# Altium project TAG_V2.PrjPcb
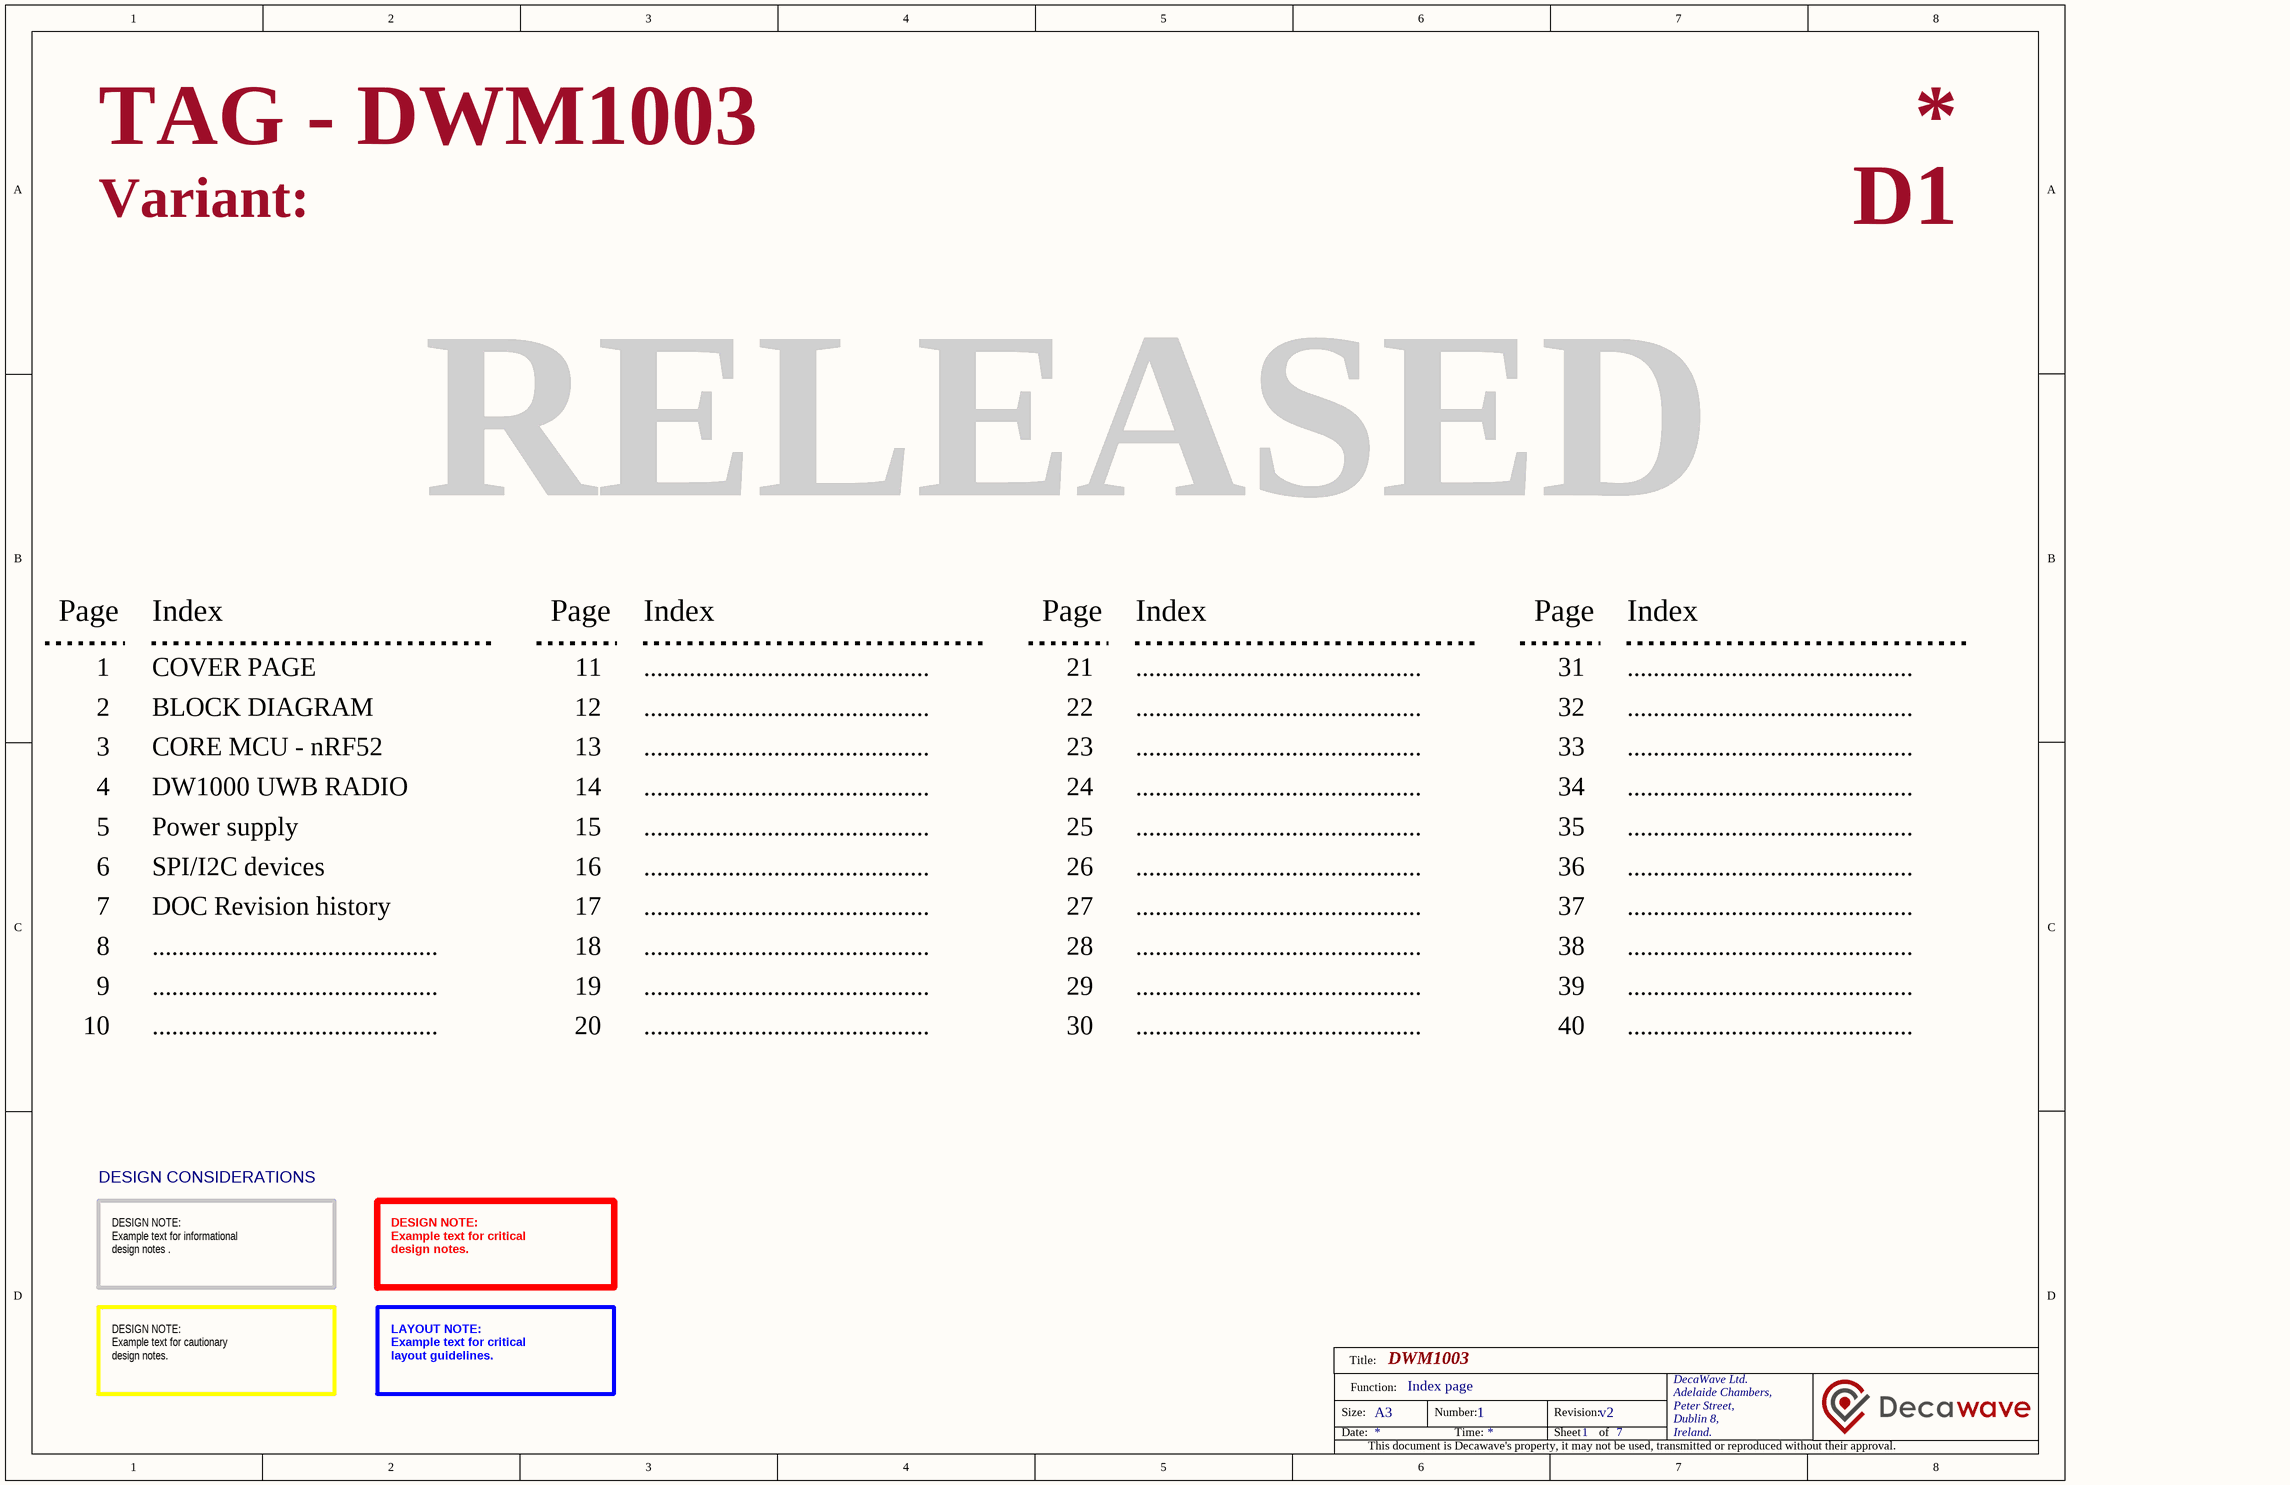
[diagram p0: [01] - COVER PAGE.SchDoc]
VersionRevision: D1; title: TAG_V2; Project_Title: 111; Project: TAG - DWM1003; DrawnBy: Ing. Jiri Kubias; Company: Decawave Limited
7 sheets, 120 parts. Net scope: flat (ports and power ports of the same name join across sheets).
Board file: TAG_V2.PcbDoc
Sheets:
  [01] - COVER PAGE.SchDoc
  [02] - BLOCK DIAGRAM.SchDoc
  [03] - CORE MCU.SchDoc
  [04] - DW radio.SchDoc
  [05] - Power supply.SchDoc
  [06] - SPI I2C devices.SchDoc
  [07] - DOC REVISION HISTORY.SchDoc

## Sheet [01] - COVER PAGE.SchDoc: DWM1003
size A3; DrawnBy: Ing. Jiri Kubias; DocumentNumber: 1; Revision: v2; SheetNumber: 1; SheetTotal: 7; SheetFunction: Index page

### Notes on the sheet
- Variant:
- RELEASED
- Page
- Index
- 1
- COVER PAGE
- 11
- ............................................
- 21
- 31
- 2
- 3
- BLOCK DIAGRAM
- CORE MCU - nRF52
- 12
- 13
- 22
- 23
- 32
- 33
- 4
- 5
- DW1000 UWB RADIO
- Power supply
- 14
- 15
- 24
- 25
- 34
- 35
- 6
- SPI/I2C devices
- 16
- 26
- 36
- 7
- 8
- DOC Revision history
- 17
- 18
- 27
- 28
- 37
- 38
- 9
- 10
- 19
- 20
- 29
- 30
- 39
- 40
- DESIGN CONSIDERATIONS
- DESIGN NOTE:
  Example text for informational
  design notes .
- DESIGN NOTE:
  Example text for critical
  design notes.
- DESIGN NOTE:
  Example text for cautionary
  design notes.
- LAYOUT NOTE:
  Example text for critical
  layout guidelines.
- Title:
- Size:
- Date:
- Function:
- A3
- Number:
- Time:
- Revision:
- Sheet
- of
- DecaWave Ltd.
- Adelaide Chambers,
- Peter Street,
- Dublin 8,
- Ireland.
- This document is Decawave's property, it may not be used, transmitted or reproduced without their approval.

## Sheet [02] - BLOCK DIAGRAM.SchDoc: DWM1003
size A3; DocumentNumber: 2; Revision: v2; SheetNumber: 2; SheetTotal: 7; SheetFunction: Block Diagram
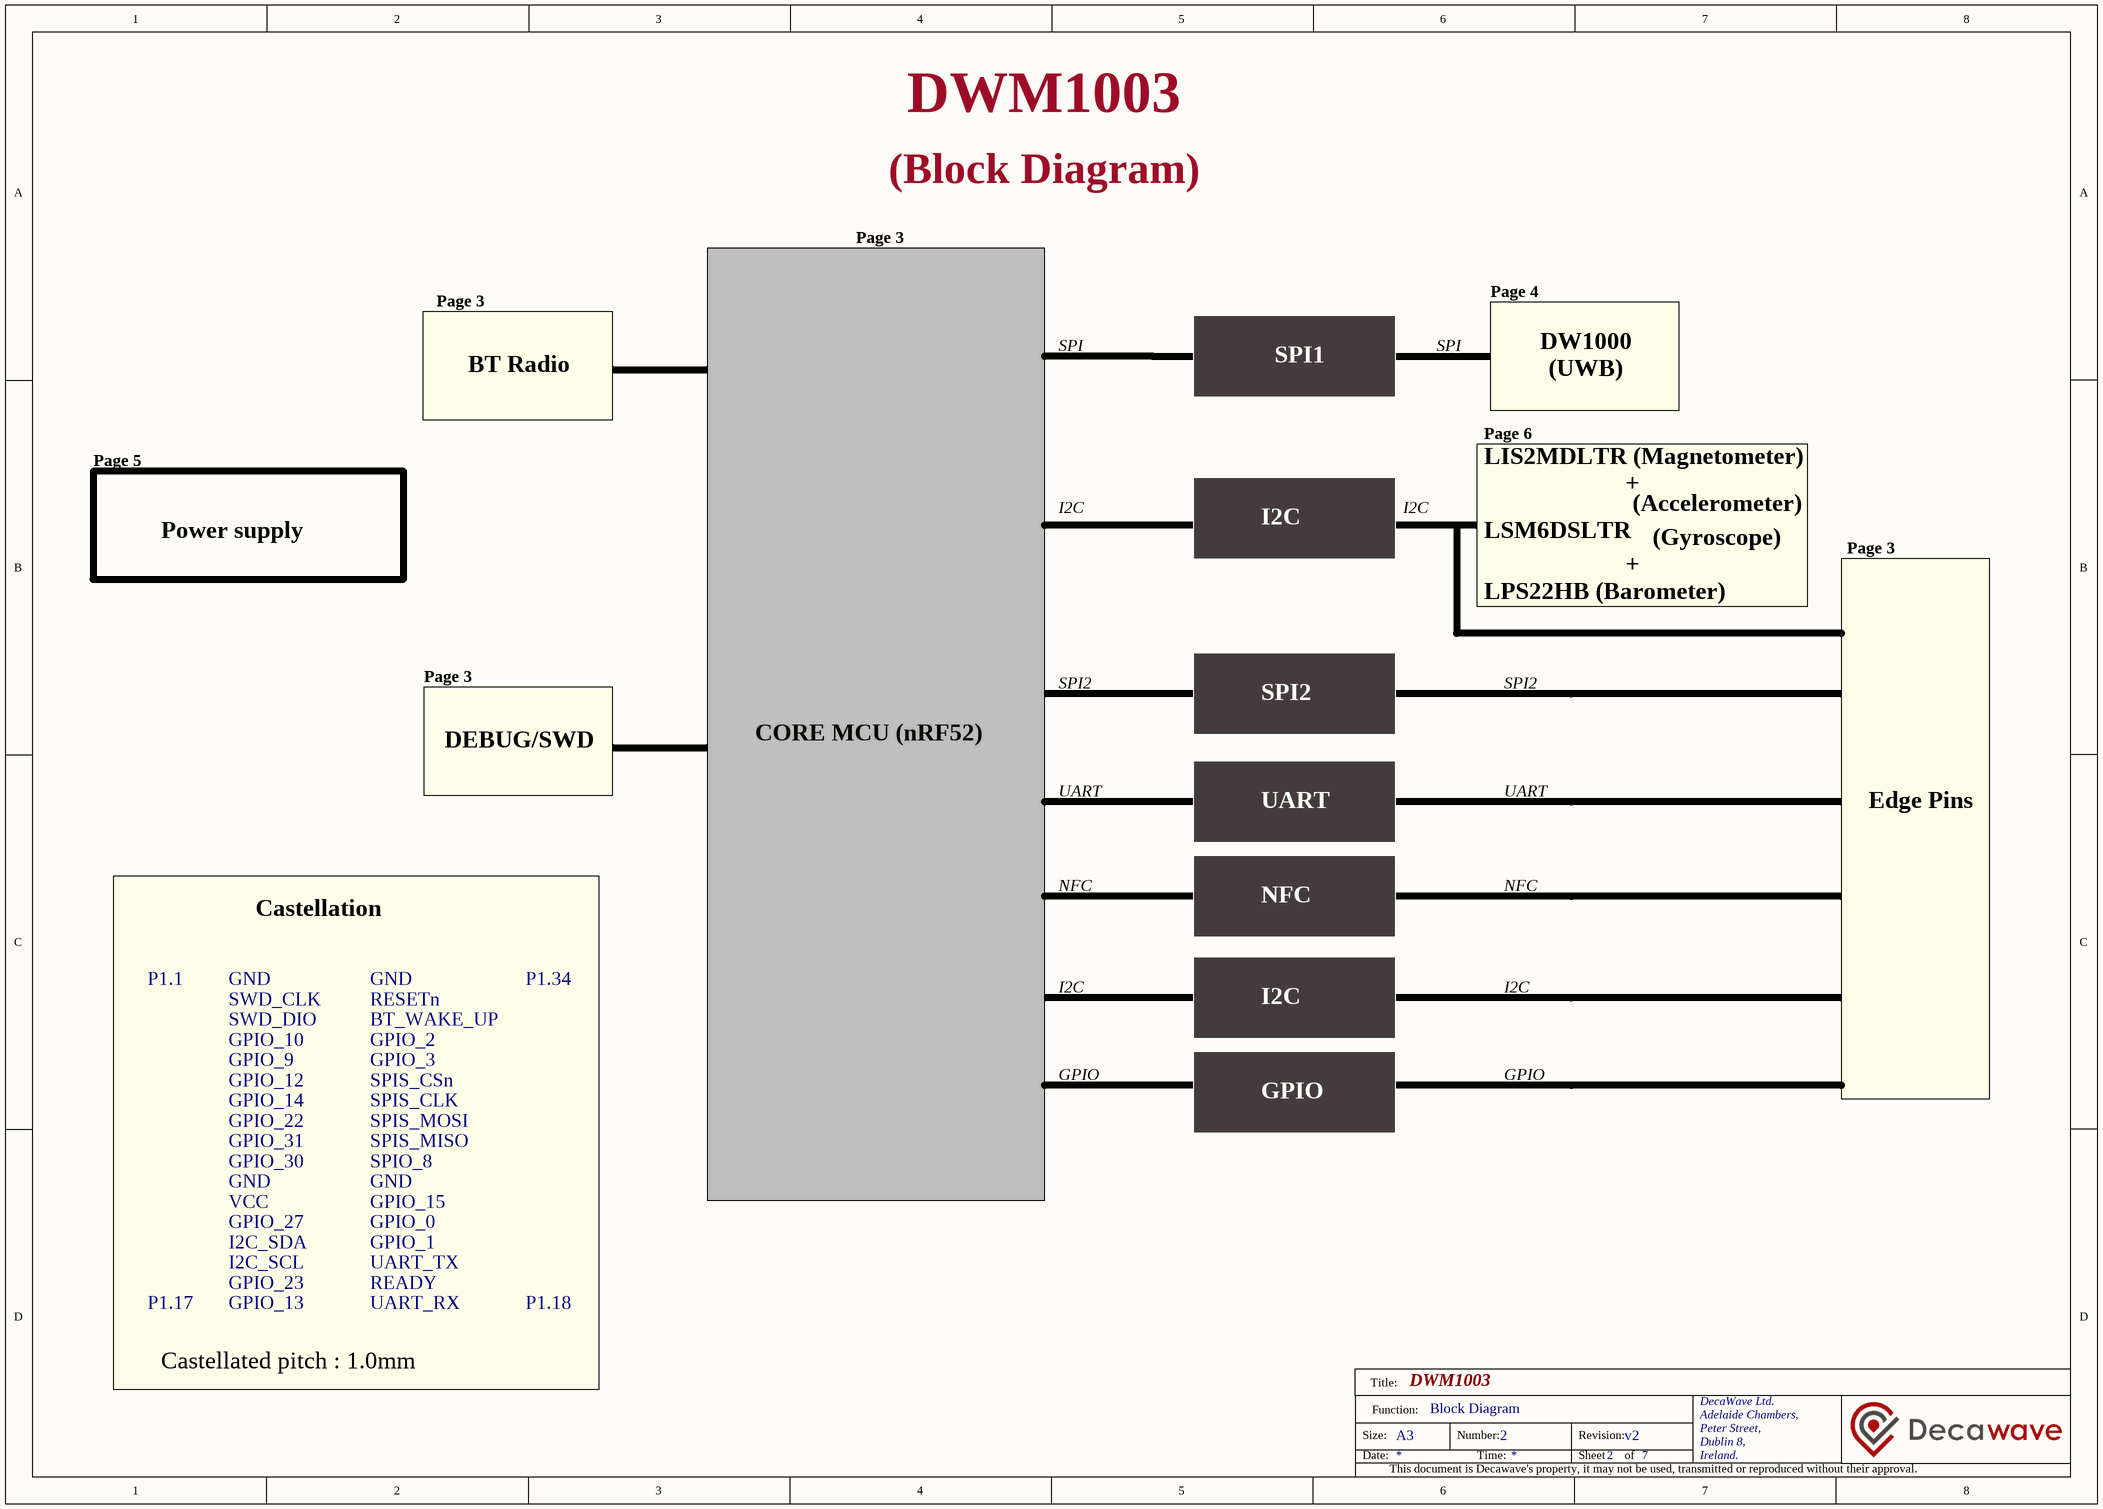
[diagram p1: [02] - BLOCK DIAGRAM.SchDoc]

### Notes on the sheet
- DWM1003
- Page 3
- (Block Diagram)
- Page 4
- BT Radio
- SPI
- SPI1
- DW1000
- (UWB)
- Page 6
- Page 5
- I2C
- LIS2MDLTR (Magnetometer)
- +
- (Accelerometer)
- Power supply
- LSM6DSLTR
- (Gyroscope)
- LPS22HB (Barometer)
- SPI2
- DEBUG/SWD
- CORE MCU (nRF52)
- UART
- Edge Pins
- Castellation
- NFC
- P1.1
- GND
- P1.34
- SWD_CLK
- SWD_DIO
- GPIO_10
- RESETn
- BT_WAKE_UP
- GPIO_2
- GPIO_9
- GPIO_12
- GPIO_14
- GPIO_22
- GPIO_3
- SPIS_CSn
- SPIS_CLK
- SPIS_MOSI
- GPIO
- GPIO_30
- GPIO_31
- SPIS_MISO
- SPIO_8
- VCC
- GPIO_27
- I2C_SDA
- GPIO_15
- GPIO_0
- GPIO_1
- P1.17
- GPIO_13
- GPIO_23
- I2C_SCL
- UART_TX
- READY
- UART_RX
- P1.18
- Castellated pitch : 1.0mm
- Title:
- Size:
- Date:
- Function:
- A3
- Number:
- Time:
- Revision:
- Sheet
- of
- DecaWave Ltd.
- Adelaide Chambers,
- Peter Street,
- Dublin 8,
- Ireland.
- This document is Decawave's property, it may not be used, transmitted or reproduced without their approval.

## Sheet [03] - CORE MCU.SchDoc: DWM1003
size A4; DocumentNumber: 3; Revision: v2; SheetNumber: 3; SheetTotal: 7; SheetFunction: nRF MCU
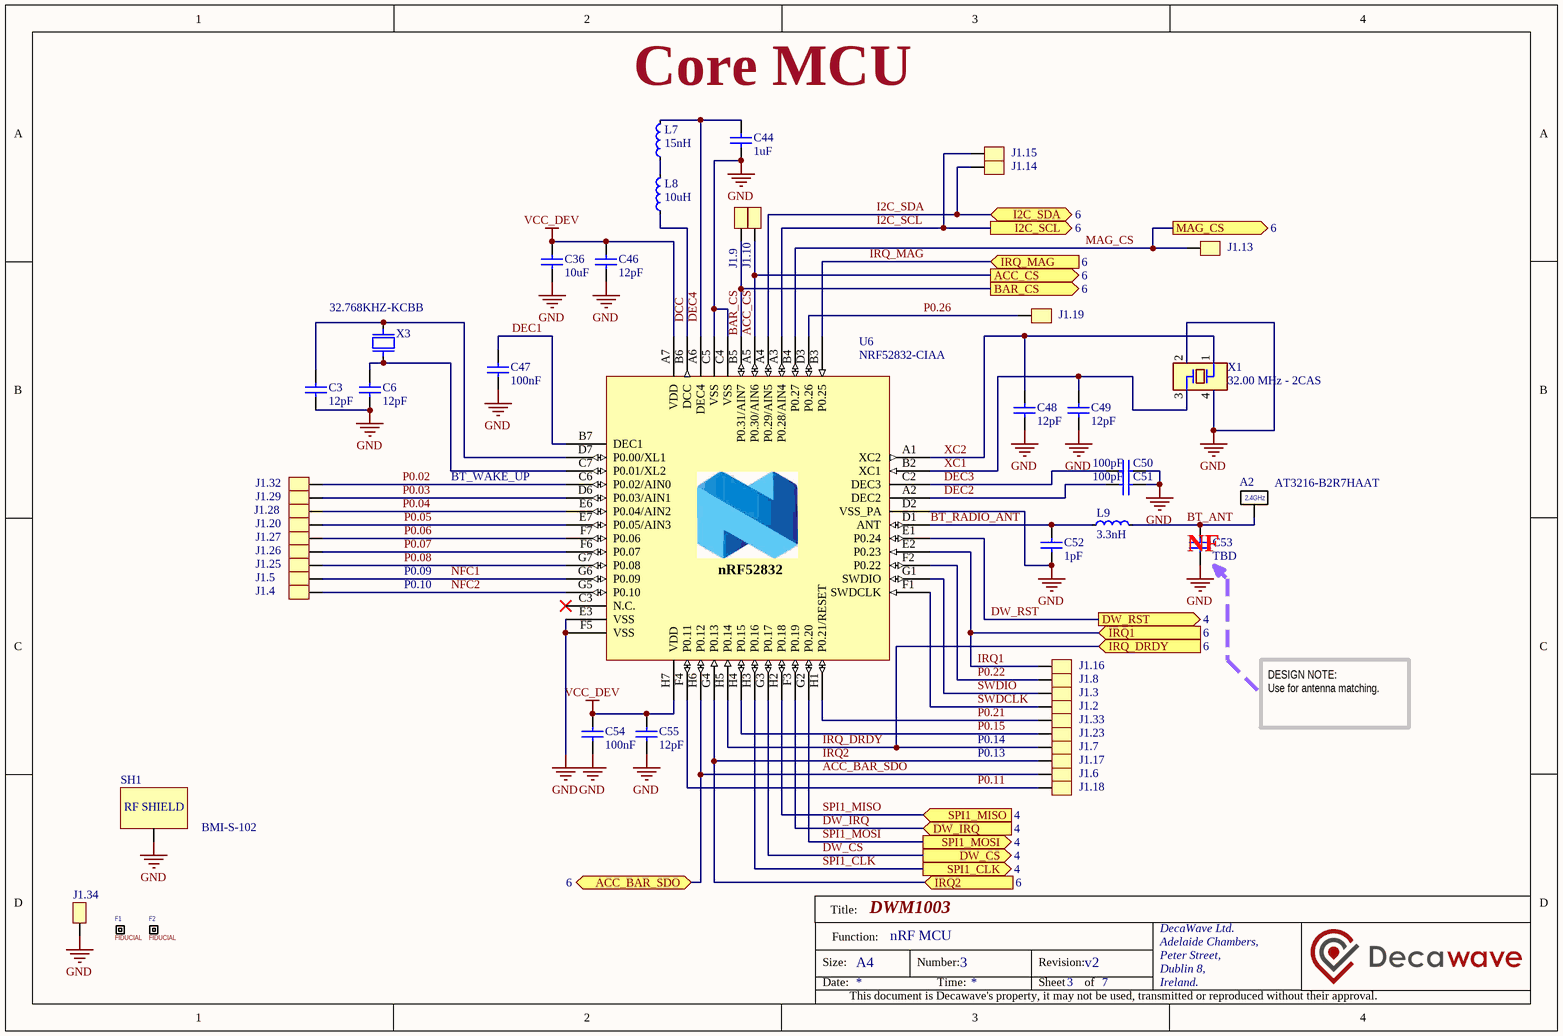
[diagram p2: [03] - CORE MCU.SchDoc]

### Parts
A2  AT3216-B2R7HAAT  [AT3216]
C3  12pF  [C0201]
C6  12pF  [C0201]
C36  10uF  [C0603]
C44  1uF  [C0402]
C46  12pF  [C0201]
C47  100nF  [C0201]
C48  12pF  [C0201]
C49  12pF  [C0201]
C50  100pF  [C0201]
C51  100pF  [C0201]
C52  1pF  [C0201]
C53  TBD  [C0201]
C54  100nF  [C0201]
C55  12pF  [C0201]
F1  FIDUCIAL  [FID1]
F2  FIDUCIAL  [FID1]
J1.2  EDGE_PIN  [PCB_EDGE_1MM]  (value not drawn)
J1.3  EDGE_PIN  [PCB_EDGE_1MM]  (value not drawn)
J1.4  EDGE_PIN  [PCB_EDGE_1MM]  (value not drawn)
J1.5  EDGE_PIN  [PCB_EDGE_1MM]  (value not drawn)
J1.6  EDGE_PIN  [PCB_EDGE_1MM]  (value not drawn)
J1.7  EDGE_PIN  [PCB_EDGE_1MM]  (value not drawn)
J1.8  EDGE_PIN  [PCB_EDGE_1MM]  (value not drawn)
J1.9  EDGE_PIN  [PCB_EDGE_1MM]  (value not drawn)
J1.10  EDGE_PIN  [PCB_EDGE_1MM]  (value not drawn)
J1.13  EDGE_PIN  [PCB_EDGE_1MM]  (value not drawn)
J1.14  EDGE_PIN  [PCB_EDGE_1MM]  (value not drawn)
J1.15  EDGE_PIN  [PCB_EDGE_1MM]  (value not drawn)
J1.16  EDGE_PIN  [PCB_EDGE_1MM]  (value not drawn)
J1.17  EDGE_PIN  [PCB_EDGE_1MM]  (value not drawn)
J1.18  EDGE_PIN  [PCB_EDGE_1MM]  (value not drawn)  (no BOM)
J1.19  EDGE_PIN  [PCB_EDGE_1MM]  (value not drawn)  (no BOM)
J1.20  EDGE_PIN  [PCB_EDGE_1MM]  (value not drawn)  (no BOM)
J1.23  EDGE_PIN  [PCB_EDGE_1MM]  (value not drawn)
J1.25  EDGE_PIN  [PCB_EDGE_1MM]  (value not drawn)
J1.26  EDGE_PIN  [PCB_EDGE_1MM]  (value not drawn)
J1.27  EDGE_PIN  [PCB_EDGE_1MM]  (value not drawn)
J1.28  EDGE_PIN  [PCB_EDGE_1MM]  (value not drawn)
J1.29  EDGE_PIN  [PCB_EDGE_1MM]  (value not drawn)
J1.32  EDGE_PIN  [PCB_EDGE_1MM]  (value not drawn)
J1.33  EDGE_PIN  [PCB_EDGE_1MM]  (value not drawn)
J1.34  EDGE_PIN  [PCB_EDGE_1MM]  (value not drawn)
L7  15nH  [INDC1005X05N]
L8  10uH  [L0603]
L9  3.3nH  [L0201]
SH1  BMI-S-102  [BMI-S102]
U6  NRF52832-CIAA  [BGA50C40P7X8_295X322X50]
X1  32.00 MHz - 2CAS  [ABM10]
X3  32.768KHZ-KCBB  [XTAL_SMD_3.2X1.5MM]

### Ports
ACC_BAR_SDO (bidir, see 6), ACC_CS (out, see 6), BAR_CS (out, see 6), DW_CS (out, see 4), DW_IRQ (in, see 4), DW_RST (out, see 4), I2C_SCL (out, see 6), I2C_SDA (bidir, see 6), IRQ1 (in, see 6), IRQ2 (in, see 6), IRQ_DRDY (in, see 6), IRQ_MAG (in, see 6), MAG_CS (out, see 6), SPI1_CLK (out, see 4), SPI1_MISO (in, see 4), SPI1_MOSI (out, see 4)

### Nets
GND: C3.1 C6.1 C36.1 C44.1 C46.1 C47.1 C48.1 C49.1 C50.1 C51.1 C52.1 C53.1 C54.1 C55.1 J1.34.0 SH1.0(GND) U6.C4(VSS) U6.C5(VSS) U6.D2(VSS_PA) U6.E3(VSS) U6.F5(VSS) X1.2 X1.4
VCC_DEV: C36.2 C46.2 C54.2 C55.2 U6.A7(VDD) U6.H7(VDD)
ACC_BAR_SDO: J1.6.0 U6.H6(P0.12) ; port ACC_BAR_SDO
ACC_CS: J1.10.0 U6.A5(P0.30/AIN6) ; port ACC_CS
BAR_CS: J1.9.0 U6.B5(P0.31/AIN7) ; port BAR_CS
BT_ANT: A2.1 C53.2 L9.2
BT_RADIO_ANT: C52.2 L9.1 U6.D1(ANT)
DCC: L8.1 U6.B6(DCC)
DEC1: C47.2 U6.B7(DEC1)
DEC2: C51.2 U6.A2(DEC2)
DEC3: C50.2 U6.C2(DEC3)
DEC4: C44.2 L7.2 U6.A6(DEC4)
DW_CS: U6.G3(P0.17) ; port DW_CS
DW_IRQ: U6.F3(P0.19) ; port DW_IRQ
DW_RST: U6.E1(P0.24) ; port DW_RST
I2C_SCL: J1.15.0 U6.A3(P0.28/AIN4) ; port I2C_SCL
I2C_SDA: J1.14.0 U6.A4(P0.29/AIN5) ; port I2C_SDA
IRQ1: J1.16.0 U6.E2(P0.23) ; port IRQ1
IRQ2: J1.17.0 U6.G4(P0.13) ; port IRQ2
IRQ_DRDY: J1.7.0 U6.H5(P0.14) ; port IRQ_DRDY
IRQ_MAG: U6.B3(P0.25) ; port IRQ_MAG
MAG_CS: J1.13.0 U6.B4(P0.27) ; port MAG_CS
NFC1: J1.5.0 U6.G6(P0.09)
NFC2: J1.4.0 U6.G5(P0.10)
P0.02: J1.32.0 U6.C6(P0.02/AIN0)
P0.03: J1.29.0 U6.D6(P0.03/AIN1)
P0.04: J1.28.0 U6.E6(P0.04/AIN2)
P0.05: J1.20.0 U6.E7(P0.05/AIN3)
P0.06: J1.27.0 U6.F7(P0.06)
P0.07: J1.26.0 U6.F6(P0.07)
P0.08: J1.25.0 U6.G7(P0.08)
P0.11: J1.18.0 U6.F4(P0.11)
P0.15: J1.23.0 U6.H4(P0.15)
P0.21: J1.33.0 U6.H1(P0.21/RESET)
P0.22: J1.8.0 U6.F2(P0.22)
P0.26: J1.19.0 U6.D3(P0.26)
SPI1_CLK: U6.H3(P0.16) ; port SPI1_CLK
SPI1_MISO: U6.H2(P0.18) ; port SPI1_MISO
SPI1_MOSI: U6.G2(P0.20) ; port SPI1_MOSI
SWDCLK: J1.2.0 U6.F1(SWDCLK)
SWDIO: J1.3.0 U6.G1(SWDIO)
XC1: C49.2 U6.B2(XC1) X1.3
XC2: C48.2 U6.A1(XC2) X1.1
NetC3_2: C3.2 U6.D7(P0.00/XL1) X3.2
NetC6_2: C6.2 U6.C7(P0.01/XL2) X3.1
NetL7_1: L7.1 L8.2

Not connected (* = marked no-connect by the designer): U6 C3(N.C.)*

### Notes on the sheet
- Core MCU
- BT_WAKE_UP
- P0.09
- (near C53) NF
- P0.10
- DESIGN NOTE:
  Use for antenna matching.
- P0.14
- P0.13
- Title:
- Size:
- Date:
- Function:
- A4
- Number:
- Time:
- Revision:
- Sheet
- of
- DecaWave Ltd.
- Adelaide Chambers,
- Peter Street,
- Dublin 8,
- Ireland.
- This document is Decawave's property, it may not be used, transmitted or reproduced without their approval.
- (in symbol AT3216-B2R7HAAT) 2.4GHz
- (in symbol BMI-S-102) RF SHIELD
- (in symbol NRF52832-CIAA-R) nRF52832

### Library data of the parts
A2 = AT3216-B2R7HAAT: CHIP, 2.45GHZ, 50 OHM, 3.2x1.6 ACX - AAT3216-B2R7HAAT- ANTENNA; Manufacturer: ACX; Manufacturer Part Number: AT3216-B2R7HAAT
C3 C6 C46 C48 C49 C55 = GRM0335C1E120JA01D: CAP CER 12PF 25V NP0 0201; Manufacturer: Murata Electronics North America; Manufacturer Part Number: GRM0335C1E120JA01D
C36 = GRM188R60J106ME84D: CAP CER 10UF 6.3V X5R 0603; Manufacturer: Murata Electronics North America; Manufacturer Part Number: GRM188R60J106ME47D
C44 = GRM155R61A105KE15D: CAP CER 1UF 10V X5R 0402; Manufacturer: Murata Electronics North America; Manufacturer Part Number: GRM155R61A105KE15D
C47 C54 = GRM033C81E104ME14D: CAP CER 0.1UF 25V X6S 0201; Manufacturer: Murata Electronics North America; Manufacturer Part Number: GRM033C81E104ME14D
C50 C51 = GRM0335C1E101JA01D: CAP CER 100PF 25V NP0 0201; Manufacturer: Murata Electronics North America; Manufacturer Part Number: GRM0335C1E101JA01D
C52 C53 = GRM0335C1H1R0BA01D: CAP CER 1PF 50V NP0 0201; Manufacturer: Murata Electronics North America; Manufacturer Part Number: GRM0335C1H1R0BA01D
F1 F2 = FID1: Fiducial 1mm
J1.2-J1.10 J1.13-J1.20 J1.23 J1.25-J1.29 J1.32-J1.34 = EDGE_PIN: PCB Edge pin
L7 = HK100515NJ-T: FIXED IND 15NH 320MA 460 MOHM; Manufacturer: Taiyo Yuden; Manufacturer Part Number: HK100515NJ-T
L8 = LBMF1608T100K: FIXED IND 10UH 80MA 360 MOHM SMD; Manufacturer: Taiyo Yuden; Manufacturer Part Number: LBMF1608T100K
L9 = LQP03TG3N3C02D: FIXED IND 3.3NH 400MA 320 MOHM; Manufacturer: Murata Electronics North America; Manufacturer Part Number: LQP03TG3N3C02D
SH1 = BMI-S-102: BOARD SHIELD .65X.65" 1PIECE; Manufacturer: Laird Technologies EMI; Manufacturer Part Number: BMI-S-102
U6 = NRF52832-CIAA-R: IC RF TXRX+MCU BLUETOOTH 50WLCSP; Manufacturer: Nordic Semiconductor ASA; Manufacturer Part Number: NRF52832-CIAA-R; RF Family/Standard: *; Protocol: *; Modulation: *; Frequency: *; Data Rate (Max): *; Power - Output: *; Sensitivity: *; Memory Size: *; Serial Interfaces: *; GPIO: *; Voltage - Supply: *; Current - Receiving: *; Current - Transmitting: *; Operating Temperature: *
X1 = ABM10: Manufacturer: Commutek; Manufacturer Part Number: 2CAS
X3 = ABS06-32.768KHZ-T: CRYSTAL 32.7680KHZ 12.5PF SMD; Manufacturer: Commutek; Manufacturer Part Number: KCBB

## Sheet [04] - DW radio.SchDoc: DWM1003
size A4; DocumentNumber: 4; Revision: v2; SheetNumber: 4; SheetTotal: 7; SheetFunction: DW1000
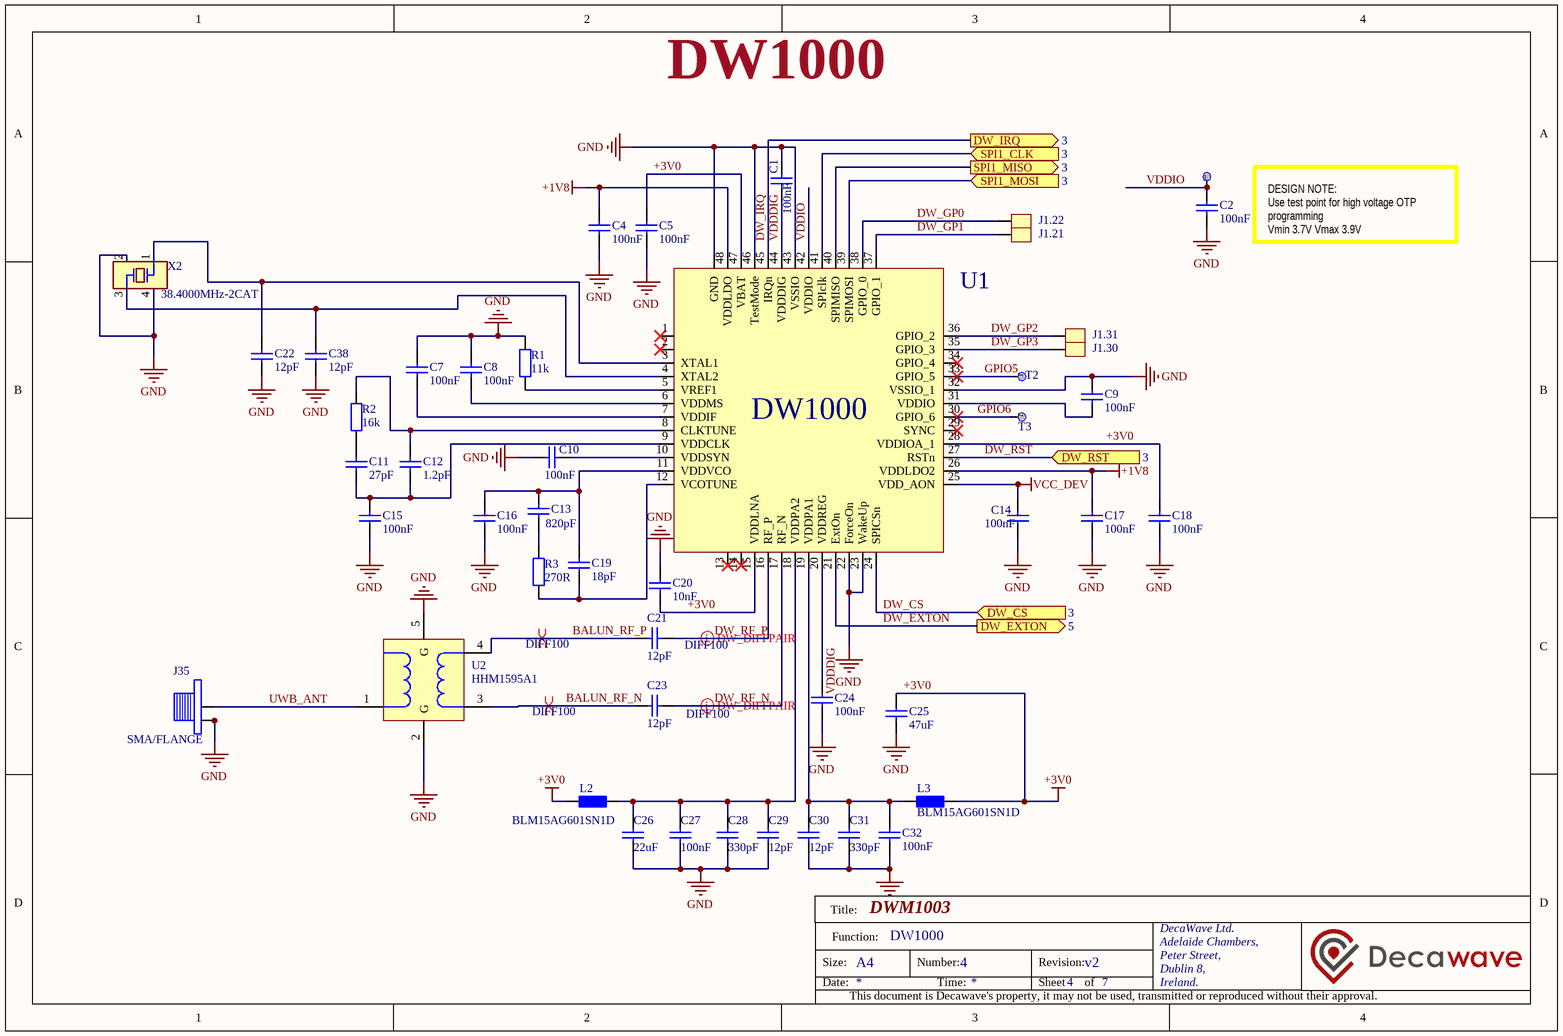
[diagram p3: [04] - DW radio.SchDoc]

### Parts
C1  100nF  [C0201]
C2  100nF  [C0201]
C4  100nF  [C0201]
C5  100nF  [C0201]
C7  100nF  [C0201]
C8  100nF  [C0201]
C9  100nF  [C0201]
C10  100nF  [C0201]
C11  27pF  [C0201]
C12  1.2pF  [C0201]
C13  820pF  [C0201]
C14  100nF  [C0201]
C15  100nF  [C0201]
C16  100nF  [C0201]
C17  100nF  [C0201]
C18  100nF  [C0201]
C19  18pF  [C0201]
C20  10nF  [C0201]
C21  12pF  [C0201]
C22  12pF  [C0201]
C23  12pF  [C0201]
C24  100nF  [C0201]
C25  47uF  [C0805]
C26  22uF  [C0805]
C27  100nF  [C0201]
C28  330pF  [C0201]
C29  12pF  [C0201]
C30  12pF  [C0201]
C31  330pF  [C0201]
C32  100nF  [C0201]
C38  12pF  [C0201]
J1.21  EDGE_PIN  [PCB_EDGE_1MM]  (value not drawn)  (no BOM)
J1.22  EDGE_PIN  [PCB_EDGE_1MM]  (value not drawn)  (no BOM)
J1.30  EDGE_PIN  [PCB_EDGE_1MM]  (value not drawn)  (no BOM)
J1.31  EDGE_PIN  [PCB_EDGE_1MM]  (value not drawn)  (no BOM)
J35  SMA/FLANGE  [SMA_KHD3800]
L2  BLM15AG601SN1D  [INDC1005X05N]
L3  BLM15AG601SN1D  [INDC1005X05N]
R1  11k  [R0201]
R2  16k  [R0201]
R3  270R  [R0201]
T1  TestPAD  [Testpad]  (value not drawn)
T2  TestPAD  [Testpad]  (value not drawn)
T3  TestPAD  [Testpad]  (value not drawn)
U1  DW1000 IC  [QFN-48_DW1000]  (value not drawn)
U2  HHM1595A1  [BALUN_HHM1595A1]
X2  38.4000MHz-2CAT  [ABM10]

### Ports
DW_CS (in, see 3), DW_EXTON (out, see 5), DW_IRQ (out, see 3), DW_RST (in, see 3), SPI1_CLK (in, see 3), SPI1_MISO (out, see 3), SPI1_MOSI (in, see 3)

### Nets
+1V8: C4.2 C17.2 U1.26(VDDLDO2) U1.48(VDDLDO)
+3V0: C5.2 C18.2 C20.1 C25.2 L2.1 L3.2 U1.15(VDDLNA) U1.28(VDDIOA_1) U1.47(VBAT)
GND: C1.1 C2.1 C4.1 C5.1 C7.2 C8.2 C9.2 C10.2 C14.1 C15.1 C16.1 C17.1 C18.1 C20.2 C22.1 C24.1 C25.1 C26.1 C27.1 C28.1 C29.1 C30.1 C31.1 C32.1 C38.1 J35.2 J35.3 J35.4 J35.5 R1.2 U1.22(ForceOn) U1.23(WakeUp) U1.32(VSSIO_1) U1.43(VSSIO) U1.46(TestMode) U1.EP(GND) U2.2(G) U2.5(G) X2.2 X2.4
VCC_DEV: C14.2 U1.25(VDD_AON)
BALUN_RF_N: C23.1 U2.3(B)
BALUN_RF_P: C21.1 U2.4(B)
DW_CS: U1.24(SPICSn) ; port DW_CS
DW_EXTON: U1.21(ExtOn) ; port DW_EXTON
DW_GP0: J1.22.0 U1.38(GPIO_0)
DW_GP1: J1.21.0 U1.37(GPIO_1)
DW_GP2: J1.31.0 U1.36(GPIO_2)
DW_GP3: J1.30.0 U1.35(GPIO_3)
DW_IRQ: U1.45(IRQn) ; port DW_IRQ
DW_RF_N: C23.2 U1.17(RF_N)
DW_RF_P: C21.2 U1.16(RF_P)
DW_RST: U1.27(RSTn) ; port DW_RST
GPIO5: T2.1 U1.33(GPIO_5)
GPIO6: T3.1 U1.30(GPIO_6)
SPI1_CLK: U1.41(SPIclk) ; port SPI1_CLK
SPI1_MISO: U1.40(SPIMISO) ; port SPI1_MISO
SPI1_MOSI: U1.39(SPIMOSI) ; port SPI1_MOSI
UWB_ANT: J35.1 U2.1(UB)
VDDDIG: C1.2 C24.2 U1.20(VDDREG) U1.44(VDDDIG)
VDDIO: C2.2 T1.1 U1.42(VDDIO)
NetC7_1: C7.1 U1.7(VDDIF)
NetC8_1: C8.1 U1.6(VDDMS)
NetC9_1: C9.1 U1.31(VDDIO)
NetC10_1: C10.1 U1.10(VDDSYN)
NetC11_1: C11.1 C12.1 C15.2 U1.9(VDDCLK)
NetC11_2: C11.2 R2.1
NetC12_2: C12.2 R2.2 U1.8(CLKTUNE)
NetC13_1: C13.1 R3.2
NetC13_2: C13.2 C16.2 C19.2 U1.11(VDDVCO)
NetC19_1: C19.1 R3.1 U1.12(VCOTUNE)
NetC22_2: C22.2 U1.3(XTAL1) X2.1
NetC26_2: C26.2 C27.2 C28.2 C29.2 L2.2 U1.18(VDDPA2)
NetC30_2: C30.2 C31.2 C32.2 L3.1 U1.19(VDDPA1)
NetC38_2: C38.2 U1.4(XTAL2) X2.3
NetR1_1: R1.1 U1.5(VREF1)

Not connected (* = marked no-connect by the designer): U1 1* 2* 13* 14* 29(SYNC)* 34(GPIO_4)*

### Layout directives
differential pair; net class DIFF100: DW_RF_N, DW_RF_P
differential pair; Class: DIFF100: BALUN_RF_N, BALUN_RF_P

### Notes on the sheet
- DW1000
- DESIGN NOTE:
  Use test point for high voltage OTP programming
  Vmin 3.7V Vmax 3.9V
- Title:
- Size:
- Date:
- Function:
- A4
- Number:
- Time:
- Revision:
- Sheet
- of
- DecaWave Ltd.
- Adelaide Chambers,
- Peter Street,
- Dublin 8,
- Ireland.
- This document is Decawave's property, it may not be used, transmitted or reproduced without their approval.
- (in symbol TestPAD) T

### Library data of the parts
C1 C2 C4 C5 C7-C10 C14-C18 C24 C27 C32 = GRM033C81E104ME14D: as C47 on sheet [03] - CORE MCU; Manufacturer Part Number: GRM033C81E104ME14D
C11 = GRM0335C1E270JA01D: CAP CER 27PF 25V NP0 0201; Manufacturer: Murata Electronics North America; Manufacturer Part Number: GRM0335C1E270JA01D
C12 = GRM0335C1E1R2CA01D: CAP CER 1.2PF 25V NP0 0201; Manufacturer: Murata Electronics North America; Manufacturer Part Number: GRM0335C1E1R2CA01D
C13 = GRM033R71E821KA01D: CAP CER 820PF 25V X7R 0201; Manufacturer: Murata Electronics North America; Manufacturer Part Number: GRM033R71E821KA01D
C19 = GRM0335C1H180JA01D: CAP CER 18PF 50V NP0 0201; Manufacturer: Murata Electronics North America; Manufacturer Part Number: GRM0335C1H180JA01D; Thickness (Max): *
C20 = GRM033R61E103KA12D: CAP CER 10000PF 25V X5R 0201; Manufacturer: Murata Electronics North America; Manufacturer Part Number: GRM033R61E103KA12D
C21-C23 C29 C30 C38 = GRM0335C1E120JA01D: as C3 on sheet [03] - CORE MCU; Manufacturer Part Number: GRM0335C1E120JA01D
C25 = GRM21BR60J226ME39L: CAP CER 47UF 6.3V X5R 0603; Manufacturer: Murata Electronics North America; Manufacturer Part Number: GRM188R60J476ME15D
C26 = GRM21BR60J226ME39L: CAP CER 22UF 6.3V X5R 0805; Manufacturer: Samsung; Manufacturer Part Number: CL21A226MQQNNNE
C28 C31 = GRM033R71E331KA01D: CAP CER 330PF 25V X7R 0201; Manufacturer: Samsung; Manufacturer Part Number: CL03B331KA3NNNC
J1.21 J1.22 J1.30 J1.31 = EDGE_PIN: PCB Edge pin
J35 = SMA/FLANGE: SMA FLANGE JACK
L2 L3 = BLM15AG601SN1D: FERRITE BEAD 600 OHM 0402 1LN; Manufacturer: Murata Electronics North America; Manufacturer Part Number: BLM15AG601SN1D
R1 = RC0201FR-0711KL: RES SMD 11K OHM 1% 1/20W 0201; Manufacturer: Yageo; Manufacturer Part Number: RC0201FR-0711KL
R2 = RC0201FR-0716KL: RES SMD 16K OHM 1% 1/20W 0201; Manufacturer: Yageo; Manufacturer Part Number: RC0201FR-0716KL
R3 = RC0201FR-07270RL: RES SMD 270 OHM 1% 1/20W 0201; Manufacturer: Yageo; Manufacturer Part Number: RC0201FR-07270RL
U1 = DW1000_QFN_48: UWB DW1000 QFN48; Manufacturer: Decawave Ltd.; Cost: *; Footprint: QFN_48; Manufacturer Part Number: DW1000
U2 = IND_BALUN_HHM1595A1: Mulitilayer Balun; Manufacturer: TDK; Manufacturer Part Number: HHM1595A1
X2 = ABM10: Manufacturer: Commutek; Manufacturer Part Number: 2CAT

## Sheet [05] - Power supply.SchDoc: DWM1003
size A4; DocumentNumber: 5; Revision: v2; SheetNumber: 5; SheetTotal: 7; SheetFunction: Power supply
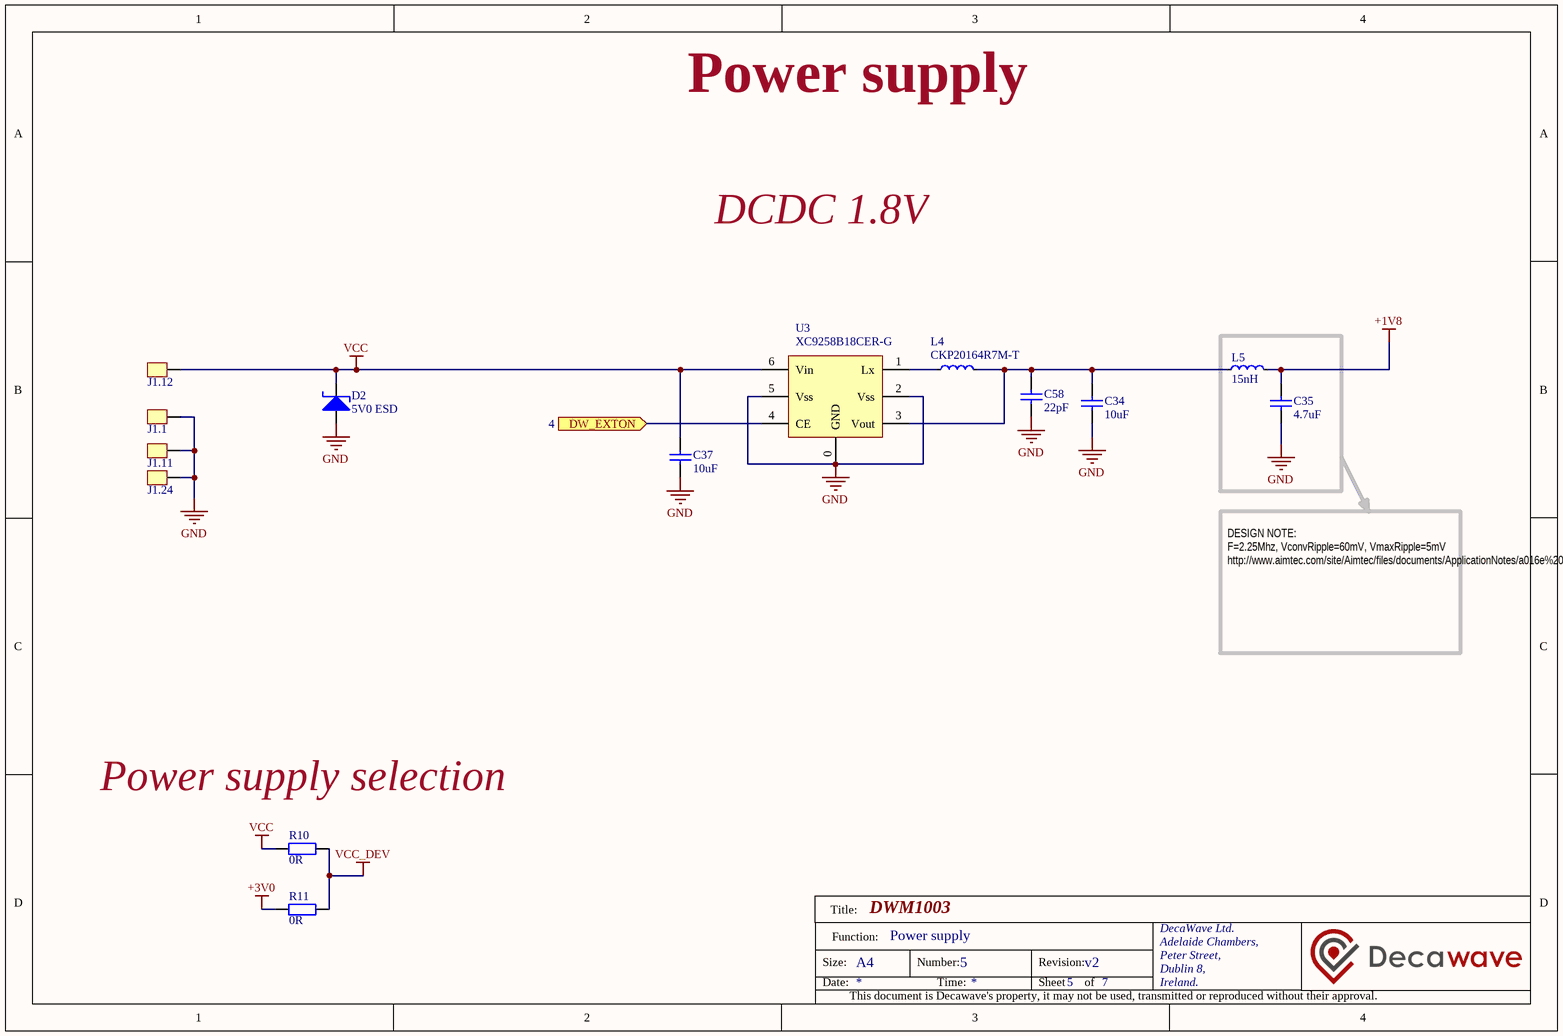
[diagram p4: [05] - Power supply.SchDoc]

### Parts
C34  10uF  [C0603]
C35  4.7uF  [C0603]
C37  10uF  [C0603]
C58  22pF  [C0201]
D2  5V0 ESD  [DFN65P100X40-2N]
J1.1  EDGE_PIN  [PCB_EDGE_1MM]  (value not drawn)  (no BOM)
J1.11  EDGE_PIN  [PCB_EDGE_1MM]  (value not drawn)  (no BOM)
J1.12  EDGE_PIN  [PCB_EDGE_1MM]  (value not drawn)  (no BOM)
J1.24  EDGE_PIN  [PCB_EDGE_1MM]  (value not drawn)  (no BOM)
L4  CKP20164R7M-T  [INDC2016X10N]
L5  15nH  [INDC1005X05N]
R10  0R  [R0201]
R11  0R  [R0201]
U3  XC9258B18CER-G  [USP-6C]

### Ports
DW_EXTON (in, see 4)

### Nets
+1V8: C35.2 L5.2
+3V0: R11.1
GND: C34.1 C35.1 C37.1 C58.1 D2.A J1.1.0 J1.11.0 J1.24.0 U3.0(GND) U3.2(Vss) U3.5(Vss)
VCC: C37.2 D2.K J1.12.0 R10.1 U3.6(Vin)
VCC_DEV: R10.2 R11.2
DW_EXTON: U3.4(CE) ; port DW_EXTON
NetC34_2: C34.2 C58.2 L4.2 L5.1 U3.3(Vout)
NetL4_1: L4.1 U3.1(Lx)

### Notes on the sheet
- Power supply
- DCDC 1.8V
- DESIGN NOTE:
  F=2.25Mhz, VconvRipple=60mV, VmaxRipple=5mV
  http://www.aimtec.com/site/Aimtec/files/documents/ApplicationNotes/a016e%20-%20reduction%20of%20output%20ripple%20&%20noise.pdf
- (near R10) Power supply selection
- Title:
- Size:
- Date:
- Function:
- A4
- Number:
- Time:
- Revision:
- Sheet
- of
- DecaWave Ltd.
- Adelaide Chambers,
- Peter Street,
- Dublin 8,
- Ireland.
- This document is Decawave's property, it may not be used, transmitted or reproduced without their approval.

### Library data of the parts
C34 = GRM188R60J106ME84D: as C36 on sheet [03] - CORE MCU
C35 = CL10A475KQ8NNN#: CAP CER 4.7UF 6.3V X5R 0603; Manufacturer: SamSung; Manufacturer Part Number: CL10A475KQ8NNN#
C37 = CL10A475KQ8NNN#: CAP CER 10UF 6.3V X5R 0603; Manufacturer: Murata Electronics North America; Manufacturer Part Number: GRM188R60J106ME47D
C58 = GRM0335C1E100JA01D: CAP CER 22PF 25V NP0 0201; Manufacturer: Murata Electronics North America; Manufacturer Part Number: GRM0335C1E220JA01D; Failure Rate: *
D2 = DF2S6.2CT,L3F: TVS DIODE 5VWM; Manufacturer: Toshiba Semiconductor and Storage; Manufacturer Part Number: DF2S6.2CT,L3F
J1.1 J1.11 J1.12 J1.24 = EDGE_PIN: PCB Edge pin
L4 = CKP20162R2M-T: FIXED IND 2.2UH 1.2A 110 MOHM; Manufacturer: TAIYO YUDEN; Manufacturer Part Number: CKP20162R2M-T
L5 = HK100515NJ-T: as L7 on sheet [03] - CORE MCU; Manufacturer Part Number: HK100515NJ-T
R10 R11 = RC0201JR-070RL: RES SMD 0.0OHM JUMPER 1/20W 0201; Manufacturer: Yageo; Manufacturer Part Number: RC0201JR-070RL
U3 = XC9257/8: Manufacturer: Torex; Manufacturer Part Number: XC9258B18CER-G

## Sheet [06] - SPI I2C devices.SchDoc: DWM1003
size A4; DocumentNumber: 6; Revision: v2; SheetNumber: 6; SheetTotal: 7; SheetFunction: 10DoF IMU
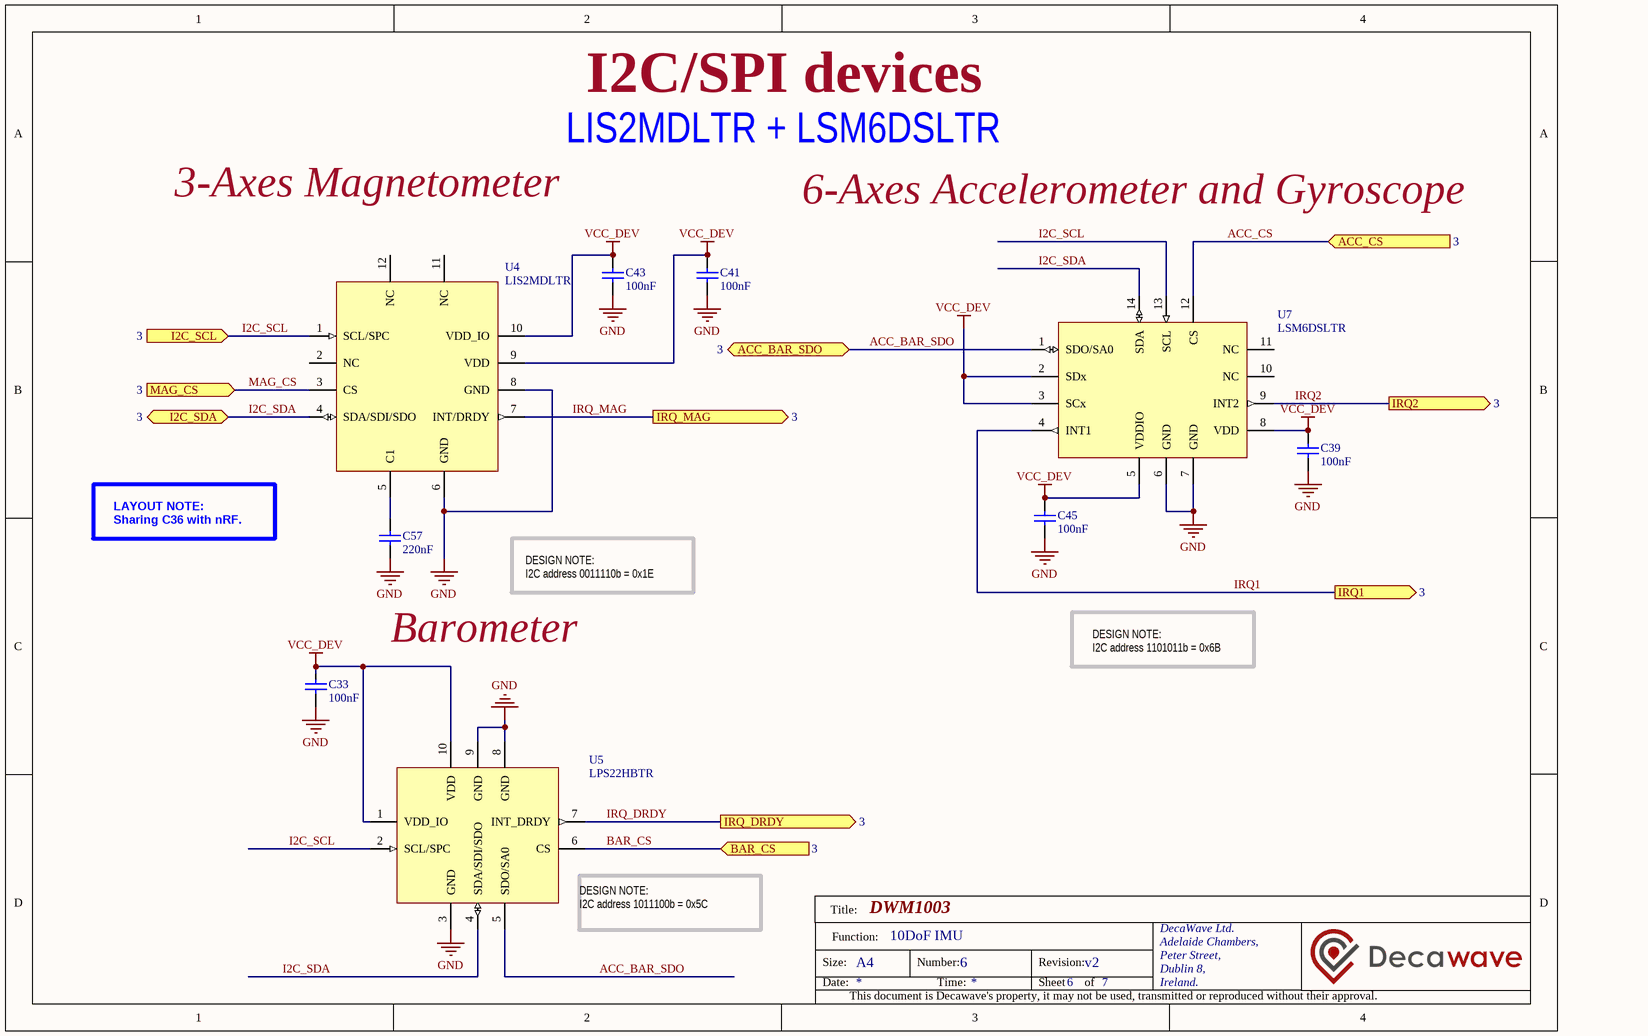
[diagram p5: [06] - SPI I2C devices.SchDoc]

### Parts
C33  100nF  [C0201]
C39  100nF  [C0201]
C41  100nF  [C0201]
C43  100nF  [C0201]
C45  100nF  [C0201]
C57  220nF  [C0201]
U4  LIS2MDLTR  [IC_LGA-12]
U5  LPS22HBTR  [HLGA-10L]
U7  LSM6DSLTR  [IC_LGA-14]

### Ports
ACC_BAR_SDO (bidir, see 3), ACC_CS (in, see 3), BAR_CS (in, see 3), I2C_SCL (in, see 3), I2C_SDA (bidir, see 3), IRQ1 (out, see 3), IRQ2 (out, see 3), IRQ_DRDY (out, see 3), IRQ_MAG (out, see 3), MAG_CS (in, see 3)

### Nets
GND: C33.1 C39.1 C41.1 C43.1 C45.1 C57.1 U4.6(GND) U4.8(GND) U5.3(GND) U5.8(GND) U5.9(GND) U7.6(GND) U7.7(GND)
VCC_DEV: C33.2 C39.2 C41.2 C43.2 C45.2 U4.9(VDD) U4.10(VDD_IO) U5.1(VDD_IO) U5.10(VDD) U7.2(SDx) U7.3(SCx) U7.5(VDDIO) U7.8(VDD)
ACC_BAR_SDO: U5.5(SDO/SA0) U7.1(SDO/SA0) ; port ACC_BAR_SDO
ACC_CS: U7.12(CS) ; port ACC_CS
BAR_CS: U5.6(CS) ; port BAR_CS
I2C_SCL: U4.1(SCL/SPC) U5.2(SCL/SPC) U7.13(SCL) ; port I2C_SCL
I2C_SDA: U4.4(SDA/SDI/SDO) U5.4(SDA/SDI/SDO) U7.14(SDA) ; port I2C_SDA
IRQ1: U7.4(INT1) ; port IRQ1
IRQ2: U7.9(INT2) ; port IRQ2
IRQ_DRDY: U5.7(INT_DRDY) ; port IRQ_DRDY
IRQ_MAG: U4.7(INT/DRDY) ; port IRQ_MAG
MAG_CS: U4.3(CS) ; port MAG_CS
NetC57_2: C57.2 U4.5(C1)

Not connected (* = marked no-connect by the designer): U4 2(NC) 11(NC) 12(NC); U7 10(NC) 11(NC)

### Notes on the sheet
- I2C/SPI devices
- LIS2MDLTR + LSM6DSLTR
- 3-Axes Magnetometer
- 6-Axes Accelerometer and Gyroscope
- (near U4) LAYOUT NOTE:
  Sharing C36 with nRF.
- Barometer
- DESIGN NOTE:
  I2C address 0011110b = 0x1E
- DESIGN NOTE:
  I2C address 1101011b = 0x6B
- (near U5) DESIGN NOTE:
  I2C address 1011100b = 0x5C
- Title:
- Size:
- Date:
- Function:
- A4
- Number:
- Time:
- Revision:
- Sheet
- of
- DecaWave Ltd.
- Adelaide Chambers,
- Peter Street,
- Dublin 8,
- Ireland.
- This document is Decawave's property, it may not be used, transmitted or reproduced without their approval.

### Library data of the parts
C33 C39 C41 C43 C45 = GRM033C81E104ME14D: as C47 on sheet [03] - CORE MCU; Manufacturer Part Number: GRM033C81E104ME14D
C57 = GRM033C81E104ME14D: CAP CER 220NF 25V X6S 0201; Manufacturer: Murata Electronics North America; Manufacturer Part Number: GRM033R61A224KE90D
U4 = LIS2MDL: Manufacturer: STmicroelectronics; Manufacturer Part Number: LIS2MDLTR
U5 = LPS22HB: Manufacturer: STmicroelectronics; Manufacturer Part Number: LPS22HBTR
U7 = LSM6DSL: Manufacturer: STmicroelectronics; Manufacturer Part Number: LSM6DSLTR

## Sheet [07] - DOC REVISION HISTORY.SchDoc: DWM1003
size A4; DocumentNumber: 7; Revision: v2; SheetNumber: 7; SheetTotal: 7; SheetFunction: Revision history
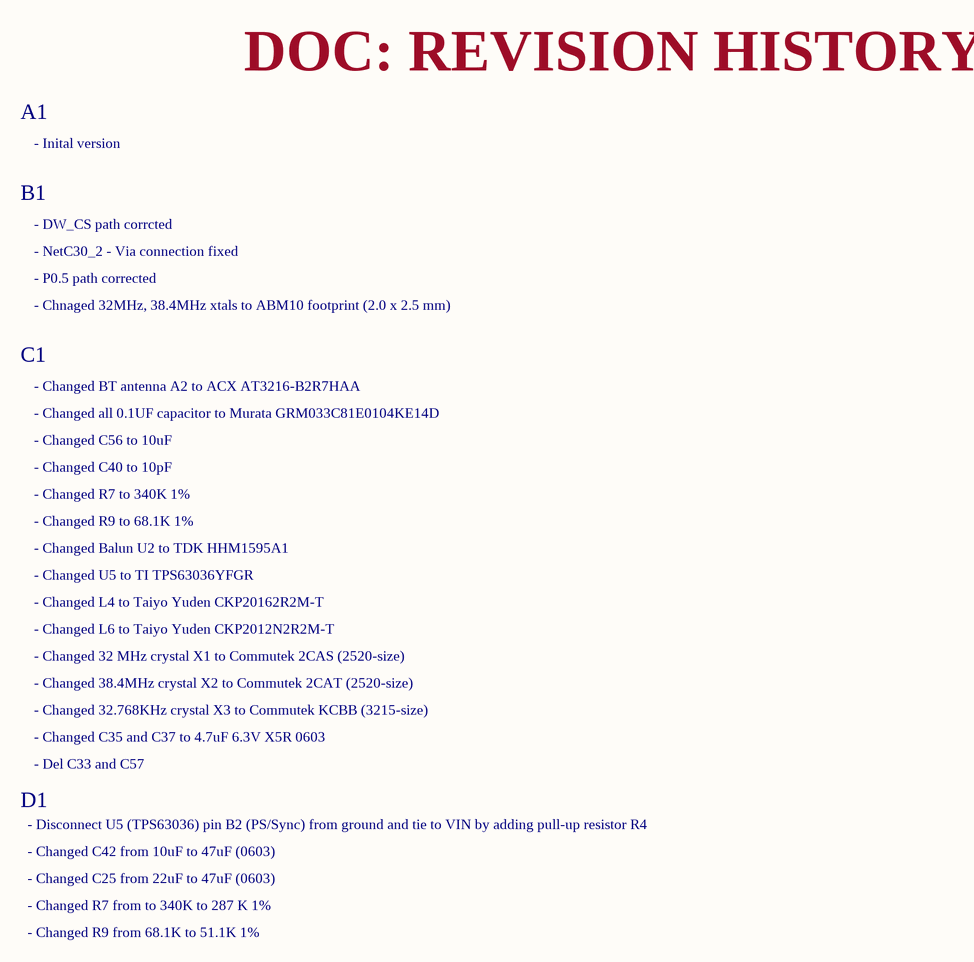
[diagram p6: [07] - DOC REVISION HISTORY.SchDoc]

### Notes on the sheet
- A1
- DOC: REVISION HISTORY
- B1
- - Inital version
- - DW_CS path corrcted
- - NetC30_2 - Via connection fixed
- - P0.5 path corrected
- - Chnaged 32MHz, 38.4MHz xtals to ABM10 footprint (2.0 x 2.5 mm)
- C1
- - Changed BT antenna A2 to ACX AT3216-B2R7HAA
- - Changed all 0.1UF capacitor to Murata GRM033C81E0104KE14D
- - Changed C56 to 10uF
- - Changed C40 to 10pF
- - Changed R7 to 340K 1%
- - Changed R9 to 68.1K 1%
- - Changed Balun U2 to TDK HHM1595A1
- - Changed U5 to TI TPS63036YFGR
- - Changed L4 to Taiyo Yuden CKP20162R2M-T
- - Changed L6 to Taiyo Yuden CKP2012N2R2M-T
- - Changed 32 MHz crystal X1 to Commutek 2CAS (2520-size)
- - Changed 38.4MHz crystal X2 to Commutek 2CAT (2520-size)
- - Changed 32.768KHz crystal X3 to Commutek KCBB (3215-size)
- - Changed C35 and C37 to 4.7uF 6.3V X5R 0603
- D1
- - Del C33 and C57
- - Disconnect U5 (TPS63036) pin B2 (PS/Sync) from ground and tie to VIN by adding pull-up resistor R4
- - Changed C42 from 10uF to 47uF (0603)
- - Changed C25 from 22uF to 47uF (0603)
- CLOCKS (CPU & PCIE)
- - Changed R7 from to 340K to 287 K 1%
- - Changed R9 from 68.1K to 51.1K 1%
- Title:
- Size:
- Date:
- Function:
- A4
- Number:
- Time:
- Revision:
- Sheet
- of
- DecaWave Ltd.
- Adelaide Chambers,
- Peter Street,
- Dublin 8,
- Ireland.
- This document is Decawave's property, it may not be used, transmitted or reproduced without their approval.

## Nets that join several sheets
+1V8: [04] - DW radio (C4.2 C17.2 U1.26 U1.48), [05] - Power supply (C35.2 L5.2)
+3V0: [04] - DW radio (9 pins), [05] - Power supply (R11.1)
GND: [03] - CORE MCU (23 pins), [04] - DW radio (40 pins), [05] - Power supply (11 pins), [06] - SPI I2C devices (13 pins)
VCC_DEV: [03] - CORE MCU (6 pins), [04] - DW radio (C14.2 U1.25), [05] - Power supply (R10.2 R11.2), [06] - SPI I2C devices (13 pins)
ACC_BAR_SDO: [03] - CORE MCU (J1.6.0 U6.H6), [06] - SPI I2C devices (U5.5 U7.1)
ACC_CS: [03] - CORE MCU (J1.10.0 U6.A5), [06] - SPI I2C devices (U7.12)
BAR_CS: [03] - CORE MCU (J1.9.0 U6.B5), [06] - SPI I2C devices (U5.6)
DW_CS: [03] - CORE MCU (U6.G3), [04] - DW radio (U1.24)
DW_EXTON: [04] - DW radio (U1.21), [05] - Power supply (U3.4)
DW_IRQ: [03] - CORE MCU (U6.F3), [04] - DW radio (U1.45)
DW_RST: [03] - CORE MCU (U6.E1), [04] - DW radio (U1.27)
I2C_SCL: [03] - CORE MCU (J1.15.0 U6.A3), [06] - SPI I2C devices (U4.1 U5.2 U7.13)
I2C_SDA: [03] - CORE MCU (J1.14.0 U6.A4), [06] - SPI I2C devices (U4.4 U5.4 U7.14)
IRQ1: [03] - CORE MCU (J1.16.0 U6.E2), [06] - SPI I2C devices (U7.4)
IRQ2: [03] - CORE MCU (J1.17.0 U6.G4), [06] - SPI I2C devices (U7.9)
IRQ_DRDY: [03] - CORE MCU (J1.7.0 U6.H5), [06] - SPI I2C devices (U5.7)
IRQ_MAG: [03] - CORE MCU (U6.B3), [06] - SPI I2C devices (U4.7)
MAG_CS: [03] - CORE MCU (J1.13.0 U6.B4), [06] - SPI I2C devices (U4.3)
SPI1_CLK: [03] - CORE MCU (U6.H3), [04] - DW radio (U1.41)
SPI1_MISO: [03] - CORE MCU (U6.H2), [04] - DW radio (U1.40)
SPI1_MOSI: [03] - CORE MCU (U6.G2), [04] - DW radio (U1.39)

## Assembly variants
nRF powered from +3V3: not fitted R6 R11